# EAGLE schematic rpi_health (EAGLE 9.3.2)
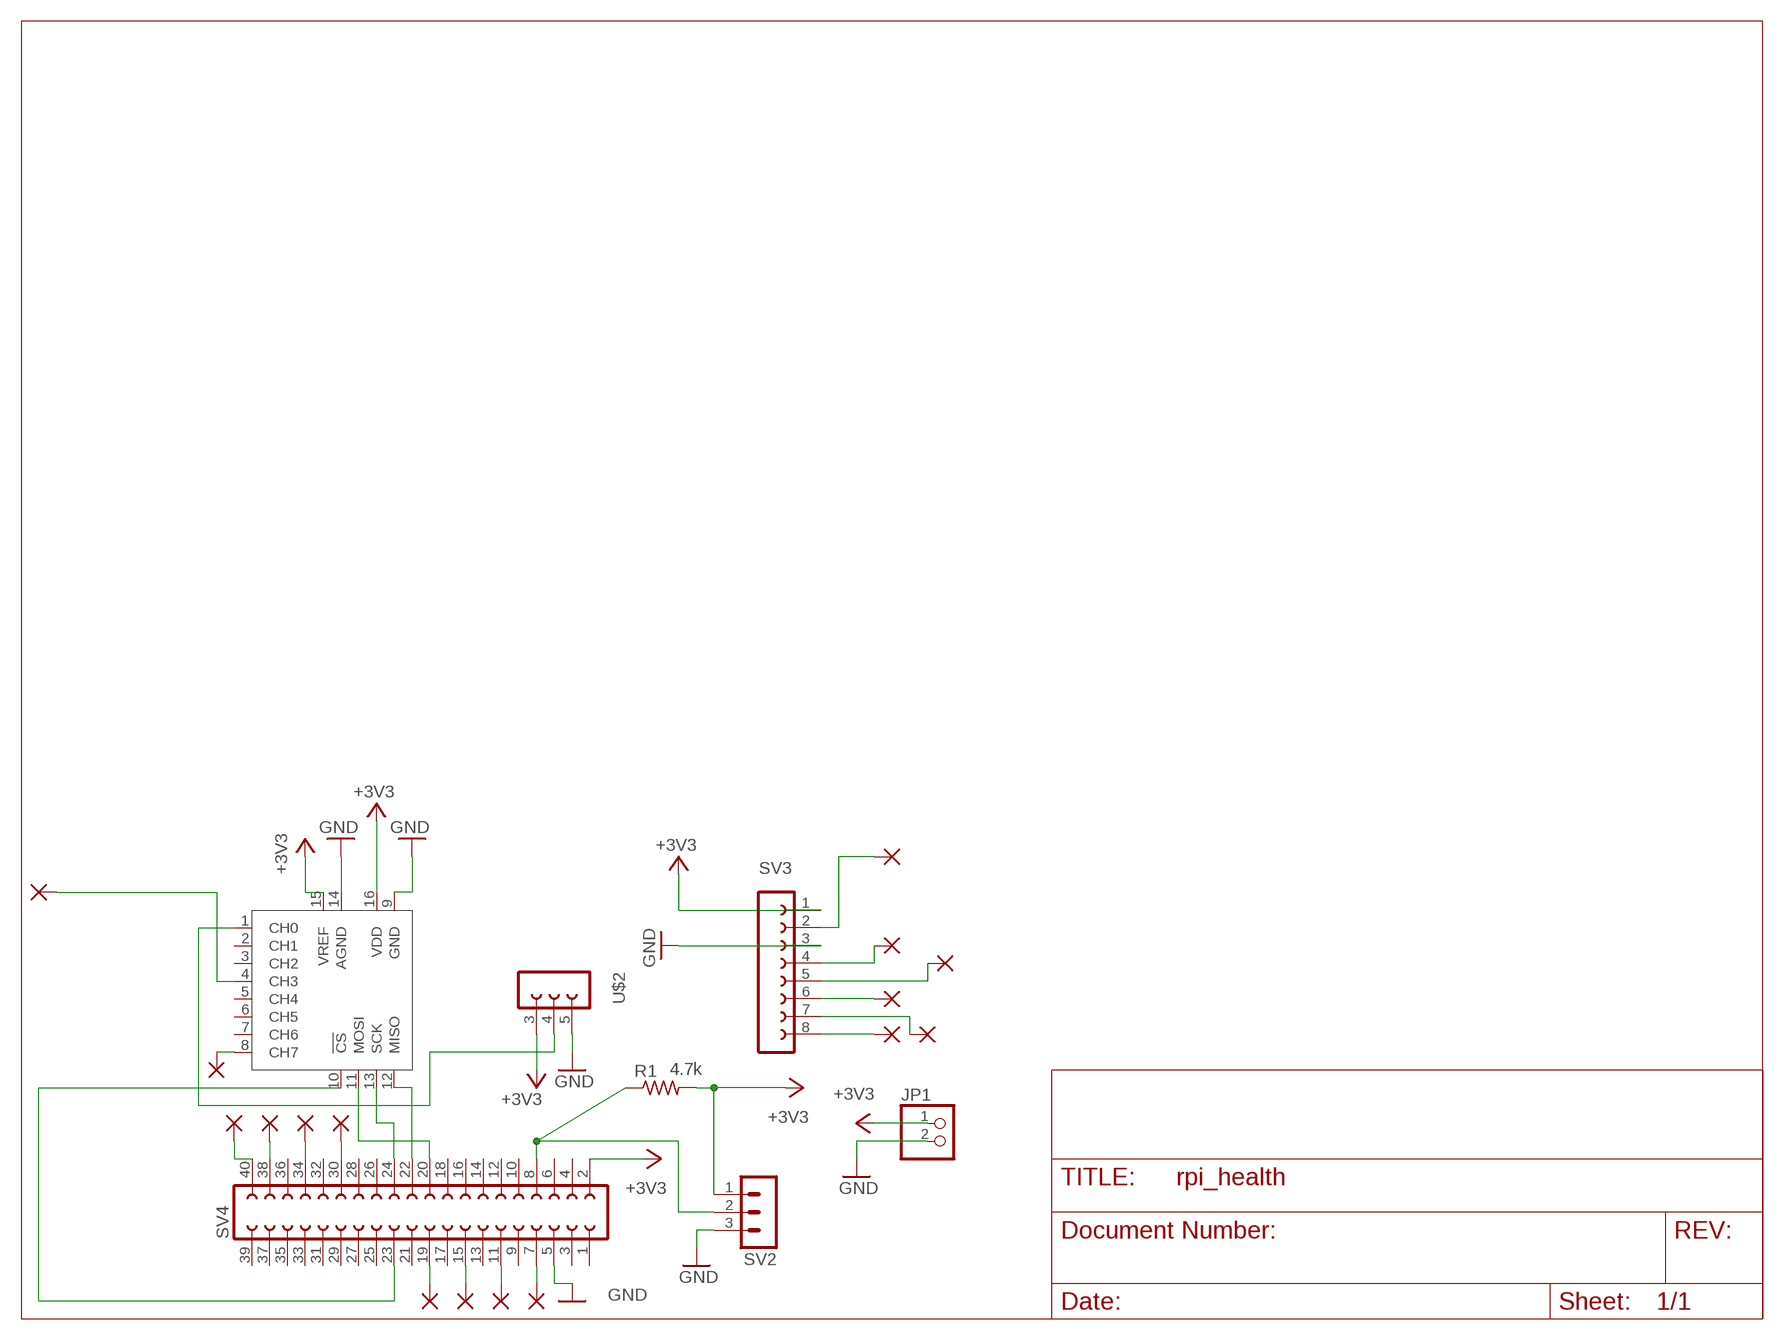
[diagram p0: schematic, sheet 1]

## Parts
JP1  PINHD-1X2  [1X02]
PAD1  1,6/0,8  [1,6/0,8]
PAD2  1,6/0,8  [1,6/0,8]
PAD3  1,6/0,8  [1,6/0,8]
PAD4  1,6/0,8  [1,6/0,8]
PAD5  1,6/0,8  [1,6/0,8]
PAD6  1,6/0,8  [1,6/0,8]
PAD7  1,6/0,8  [1,6/0,8]
PAD8  1,6/0,8  [1,6/0,8]
PAD9  1,6/0,8  [1,6/0,8]
PAD10  1,6/0,8  [1,6/0,8]
PAD11  1,6/0,8  [1,6/0,8]
PAD12  1,6/0,8  [1,6/0,8]
PAD13  1,6/0,8  [1,6/0,8]
PAD14  1,6/0,8  [1,6/0,8]
PAD15  1,6/0,8  [1,6/0,8]
PAD16  1,6/0,8  [1,6/0,8]
R1  4.7k  R-US_0204/5  [0204/5]
SV2  MA03-1  [MA03-1]
SV3  FE08-1  [FE08]
SV4  FE20-2  [FE20-2]
U$1  MCP3008SL  [SO16]
U$2  FE03-1FE03-1  [FE05-1]

## Nets
+3V3: JP1.1 R1.2 SV2.1 SV3.1 SV4.2 U$1.15(VREF) U$1.16(VDD) U$2.3
GND: JP1.2 SV2.3 SV3.3 SV4.5 U$1.9(GND) U$1.14(AGND) U$2.5
N$1: SV4.23 U$1.10(!CS)
N$2: SV4.24 U$1.13(SCK)
N$3: SV4.22 U$1.12(MISO)
N$4: SV4.20 U$1.11(MOSI)
N$5: R1.1 SV2.2 SV4.8
N$7: PAD5.1(P) SV3.2
N$8: U$1.1(CH0) U$2.4
N$9: PAD1.1(P) SV3.4
N$10: PAD2.1(P) SV3.5
N$11: PAD3.1(P) SV3.6
N$12: PAD6.1(P) SV3.7
N$13: PAD7.1(P) SV3.8
N$14: PAD14.1(P) SV4.40
N$15: PAD13.1(P) SV4.38
N$16: PAD12.1(P) SV4.34
N$17: PAD11.1(P) SV4.30
N$18: PAD4.1(P) SV4.7
N$19: PAD8.1(P) SV4.11
N$20: PAD9.1(P) SV4.15
N$21: PAD10.1(P) SV4.19
N$22: PAD15.1(P) U$1.4(CH3)
N$23: PAD16.1(P) U$1.8(CH7)
Unconnected: SV4.1 SV4.3 SV4.4 SV4.6 SV4.9 SV4.10 SV4.12 SV4.13 SV4.14 SV4.16 SV4.17 SV4.18 SV4.21 SV4.25 SV4.26 SV4.27 SV4.28 SV4.29 SV4.31 SV4.32 SV4.33 SV4.35 SV4.36 SV4.37 SV4.39 U$1.2(CH1) U$1.3(CH2) U$1.5(CH4) U$1.6(CH5) U$1.7(CH6)

## Library data of the parts
JP1 = pinhead:PINHD-1X2: PIN HEADER
PAD1-PAD16 = wirepad:1,6/0,8: THROUGH-HOLE PAD
R1 = rcl:R-US_: RESISTOR, American symbol; SPICEPREFIX: R
SV2 = con-lstb:MA03-1: PIN HEADER; OC_FARNELL: unknown; OC_NEWARK: unknown
SV3 = con-lsta:FE08-1: FEMALE HEADER; OC_FARNELL: unknown; OC_NEWARK: unknown
SV4 = con-lsta:FE20-2: FEMALE HEADER; OC_FARNELL: unknown; OC_NEWARK: unknown
U$1 = MCP3008:MCP3008
U$2 = FE03-1:FE03-1